# EAGLE design Quadcopter_Schematic_Final (EAGLE 7.2.0)
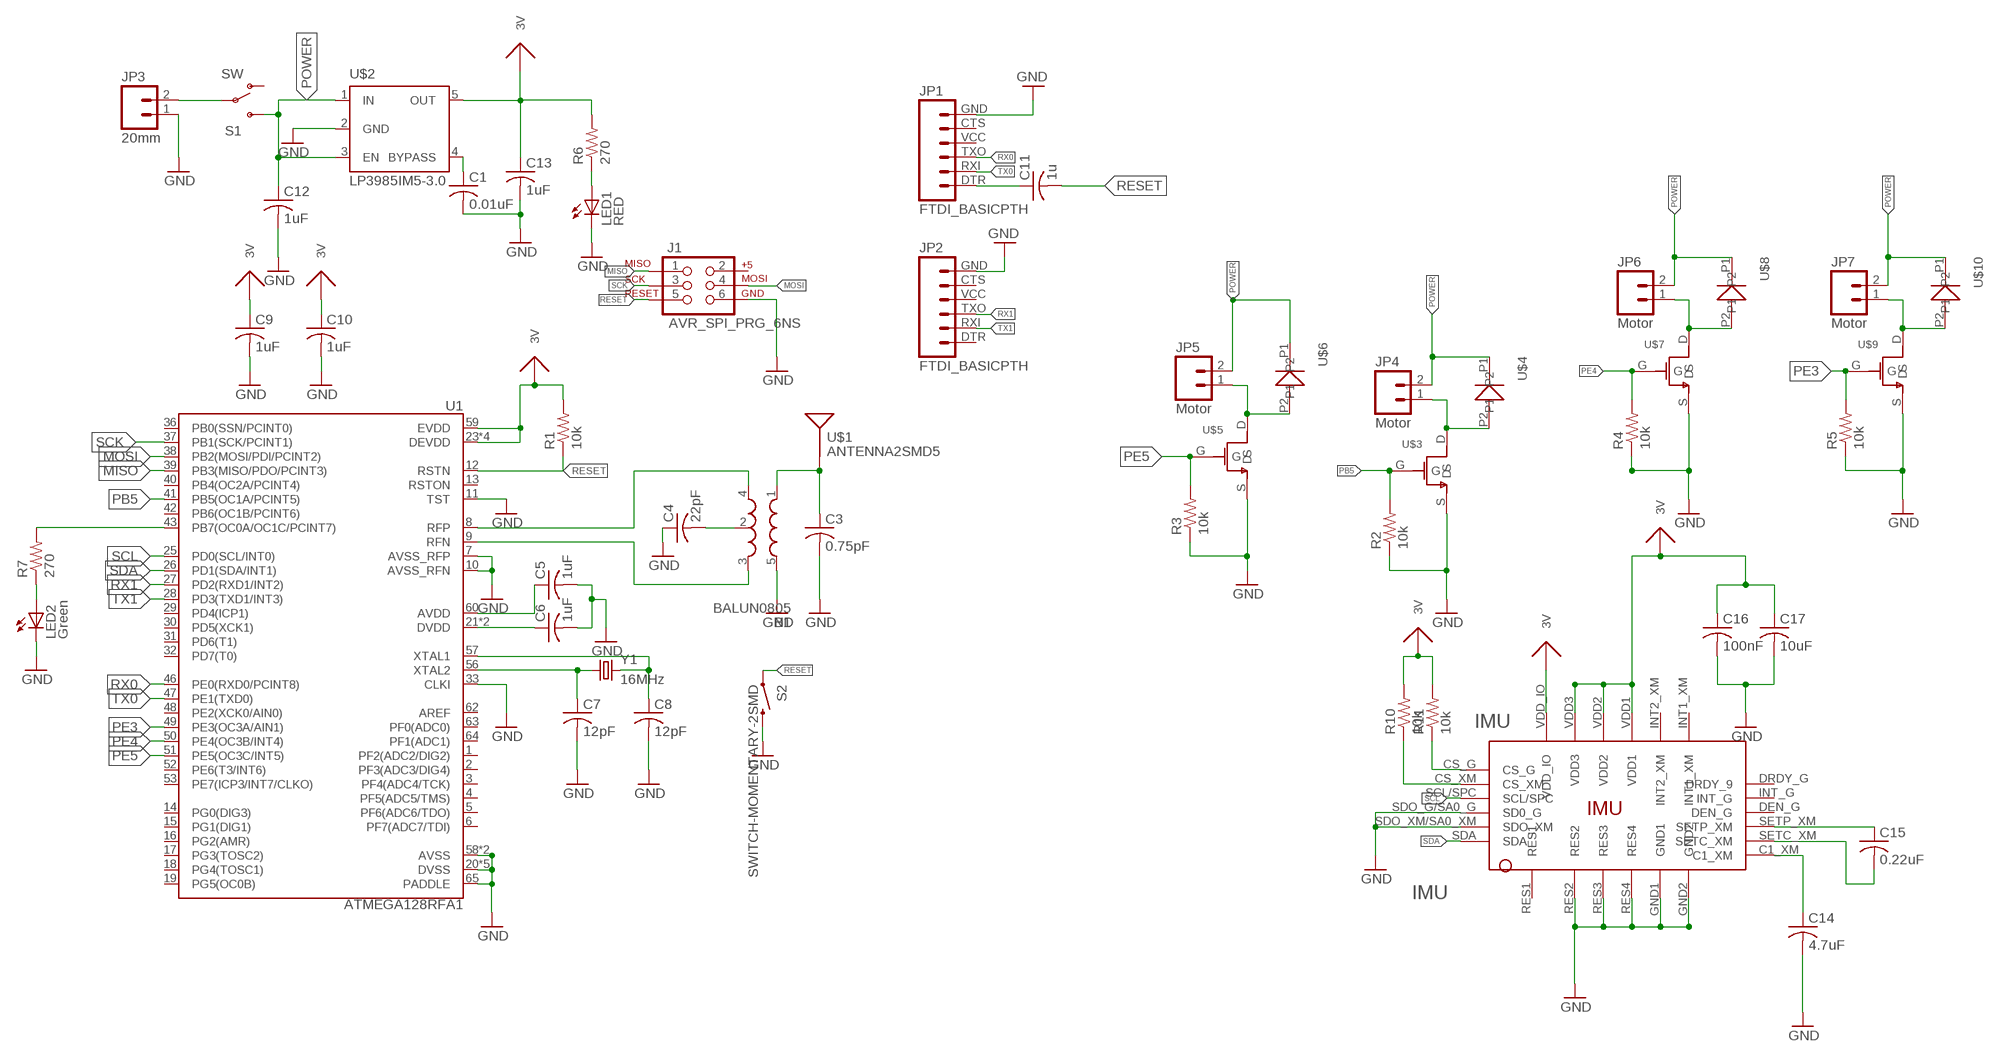
[diagram p0: schematic, sheet 1]

## Parts
B1  BALUN0805  [BALUN]
C1  0.01uF  C-USC0805  [C0805]
C3  0.75pF  C-USC0805  [C0805]
C4  22pF  C-USC0805  [C0805]
C5  1uF  C-USC0805  [C0805]
C6  1uF  C-USC0805  [C0805]
C7  12pF  C-USC0805  [C0805]
C8  12pF  C-USC0805  [C0805]
C9  1uF  C-USC0805  [C0805]
C10  1uF  C-USC0805  [C0805]
C11  1u  C-USC0805  [C0805]
C12  1uF  C-USC0805  [C0805]
C13  1uF  C-USC0805  [C0805]
C14  4.7uF  C-USC0805  [C0805]
C15  0.22uF  C-USC0805  [C0805]
C16  100nF  C-USC0805  [C0805]
C17  10uF  C-USC0805  [C0805]
IMU  IMU  LSM9DS0  [LSM9DS0]
J1  AVR_SPI_PRG_6NS  [2X3-NS]
JP1  FTDI_BASICPTH  [FTDI_BASIC]
JP2  FTDI_BASICPTH  [FTDI_BASIC]
JP3  20mm  M02PTH  [1X02]
JP4  Motor  M02PTH  [1X02]
JP5  Motor  M02PTH  [1X02]
JP6  Motor  M02PTH  [1X02]
JP7  Motor  M02PTH  [1X02]
LED1  RED  LEDCHIP-LED0805  [CHIP-LED0805]
LED2  Green  LEDCHIP-LED0805  [CHIP-LED0805]
R1  10k  R-US_R0805  [R0805]
R2  10k  R-US_R0805  [R0805]
R3  10k  R-US_R0805  [R0805]
R4  10k  R-US_R0805  [R0805]
R5  10k  R-US_R0805  [R0805]
R6  270  R-US_R0805  [R0805]
R7  270  R-US_R0805  [R0805]
R10  10k  R-US_R0805  [R0805]
R11  10k  R-US_R0805  [R0805]
S1  SW  SWITCH-SPDTPTH  [SWITCH-SPDT]
S2  SWITCH-MOMENTARY-2SMD  [TACTILE_SWITCH_SMD]
U1  ATMEGA128RFA1  [QFN-64]
U$1  ANTENNA2SMD5  [ANTENNA-CHIP5]
U$2  LP3985IM5-3.0  [SOT23-DBV]
U$3  NMOS  SI2302DS_MOSFET  [SI2302DS_MOSFET]
U$4  Diode  BAS16WS_DIODE  [BAS16WS_DIODE]
U$5  NMOS  SI2302DS_MOSFET  [SI2302DS_MOSFET]
U$6  Diode  BAS16WS_DIODE  [BAS16WS_DIODE]
U$7  NMOS  SI2302DS_MOSFET  [SI2302DS_MOSFET]
U$8  Diode  BAS16WS_DIODE  [BAS16WS_DIODE]
U$9  NMOS  SI2302DS_MOSFET  [SI2302DS_MOSFET]
U$10  Diode  BAS16WS_DIODE  [BAS16WS_DIODE]
Y1  16MHz  CRYSTAL5X3  [CRYSTAL-SMD-5X3]

## Nets
3V: C9.1 C10.1 C13.1 C16.1 C17.1 IMU.VDD1 IMU.VDD2 IMU.VDD3 IMU.VDD_IO R1.2 R6.2 R10.2 R11.2 U1.23(DEVDD) U1.34(DEVDD) U1.44(DEVDD) U1.54(DEVDD) U1.59(EVDD) U$2.5(OUT)
FTDI: C11.1 JP1.DTR
GND: B1.5(GND) C1.2 C3.2 C4.1 C5.2 C6.2 C7.2 C8.2 C9.2 C10.2 C12.2 C13.2 C14.2 C16.2 C17.2 IMU.GND1 IMU.GND2 IMU.RES2 IMU.RES3 IMU.RES4 IMU.SDO_G/SA0_G(SD0_G) IMU.SDO_XM/SA0_XM(SDO_XM) J1.6 JP1.GND JP2.GND JP3.1 LED1.C LED2.C R2.1 R3.1 R4.1 R5.1 S2.3 U1.7(AVSS_RFP) U1.10(AVSS_RFN) U1.11(TST) U1.20(DVSS) U1.24(DVSS) U1.33(CLKI) U1.35(DVSS) U1.45(DVSS) U1.55(DVSS) U1.58(AVSS) U1.61(AVSS) U1.65(PADDLE) U$2.2(GND) U$3.S U$5.S U$7.S U$9.S
MISO: J1.1 U1.39(PB3(MISO/PDO/PCINT3))
MOSI: J1.4 U1.38(PB2(MOSI/PDI/PCINT2))
N$1: B1.4(OUT1) U1.8(RFP)
N$2 [HIGHCURRENT]: JP5.1 U$5.D U$6.P2
N$3: JP3.2 S1.2(P)
N$4: C5.1 U1.60(AVDD)
N$5: C6.1 U1.21(DVDD) U1.22(DVDD)
N$6: B1.2(GND) C4.2
N$7: B1.3(OUT2) U1.9(RFN)
N$8: C8.1 U1.57(XTAL1) Y1.3
N$9 [RFSIG]: B1.1(IN) C3.1 U$1.FEED(SIGNAL)
N$10: LED1.A R6.1
N$11: LED2.A R7.1
N$12: C7.1 U1.56(XTAL2) Y1.1
N$14: C1.1 U$2.4(BYPASS)
N$15: IMU.CS_G R11.1
N$16: IMU.CS_XM R10.1
N$22 [HIGHCURRENT]: JP4.1 U$3.D U$4.P2
N$23: C14.1 IMU.C1_XM
N$24: C15.2 IMU.SETC_XM
N$25: C15.1 IMU.SETP_XM
N$33 [HIGHCURRENT]: JP6.1 U$7.D U$8.P2
N$38: JP7.1 U$9.D U$10.P2
PB5: R2.2 U1.41(PB5(OC1A/PCINT5)) U$3.G
PB7: R7.2 U1.43(PB7(OC0A/OC1C/PCINT7))
PE3: R5.2 U1.49(PE3(OC3A/AIN1)) U$9.G
PE4: R4.2 U1.50(PE4(OC3B/INT4)) U$7.G
PE5: R3.2 U1.51(PE5(OC3C/INT5)) U$5.G
POWER [HIGHCURRENT]: C12.1 JP4.2 JP5.2 JP6.2 JP7.2 S1.3(S) U$2.1(IN) U$2.3(EN) U$4.P1 U$6.P1 U$8.P1 U$10.P1
RESET: C11.2 J1.5 R1.1 S2.1 U1.12(RSTN)
RX0: JP1.TXO U1.46(PE0(RXD0/PCINT8))
RX1: JP2.TXO U1.27(PD2(RXD1/INT2))
SCK: J1.3 U1.37(PB1(SCK/PCINT1))
SCL: IMU.SCL/SPC U1.25(PD0(SCL/INT0))
SDA: IMU.SDA U1.26(PD1(SDA/INT1))
TX0: JP1.RXI U1.47(PE1(TXD0))
TX1: JP2.RXI U1.28(PD3(TXD1/INT3))
Unconnected: IMU.DEN_G IMU.DRDY_G(DRDY_9) IMU.INT1_XM IMU.INT2_XM IMU.INT_G IMU.RES1 J1.2 JP1.CTS JP1.VCC JP2.CTS JP2.DTR JP2.VCC S1.1(O) U1.1(PF2(ADC2/DIG2)) U1.2(PF3(ADC3/DIG4)) U1.3(PF4(ADC4/TCK)) U1.4(PF5(ADC5/TMS)) U1.5(PF6(ADC6/TDO)) U1.6(PF7(ADC7/TDI)) U1.13(RSTON) U1.14(PG0(DIG3)) U1.15(PG1(DIG1)) U1.16(PG2(AMR)) U1.17(PG3(TOSC2)) U1.18(PG4(TOSC1)) U1.19(PG5(OC0B)) U1.29(PD4(ICP1)) U1.30(PD5(XCK1)) U1.31(PD6(T1)) U1.32(PD7(T0)) U1.36(PB0(SSN/PCINT0)) U1.40(PB4(OC2A/PCINT4)) U1.42(PB6(OC1B/PCINT6)) U1.48(PE2(XCK0/AIN0)) U1.52(PE6(T3/INT6)) U1.53(PE7(ICP3/INT7/CLKO)) U1.62(AREF) U1.63(PF0(ADC0)) U1.64(PF1(ADC1))

## Library data of the parts
B1 = Lab5:BALUN: 0805 footprint balun- Ember 351/357
C1 C3-C17 = Lab5:C-US: CAPACITOR, American symbol
IMU = Andranik-Lab4:LSM9DS0; DIST: Digikey; DISTPN: LSM9DS0
J1 = Lab5:AVR_SPI_PRG_6: AVR ISP 6 Pin This is the reduced ISP connector for AVR programming. Common on Arduino. This footprint will take up less PCB space and can be used with a 10-pin to 6-pin adapter such as SKU: BOB-08508
JP1 JP2 = Lab5:FTDI_BASIC: FTDI Basic header with labels
JP3-JP7 = Lab5:M02: Header 2 Standard 2-pin 0.1" header. Use with straight break away headers (SKU : PRT-00116), right angle break away headers (PRT-00553), swiss pins (PRT-00743), machine pins (PRT-00117), and female headers (PRT-00115). Molex polarized connector foot print use with SKU : PRT-08233 with associated crimp pins and housings.
LED1 LED2 = Lab5:LED: LED OSRAM: - CHIPLED LG R971, LG N971, LY N971, LG Q971, LY Q971, LO R971, LY R971 LH N974, LH R974 LS Q976, LO Q976, LY Q976 LO Q996 - Hyper CHIPLED LW Q18S LB Q993, LB Q99A, LB R99A - SideLED LS A670, LO A670, LY A670, LG A670, LP A670 LB A673, LV A673, LT A673, LW A673 LH A674 LY A675 LS A676, LA A676, LO A676, LY A676, LW A676 LS A679, LY A679, LG A679 - Hyper Micro SIDELED® LS Y876, LA Y876, LO Y876, LY Y876 LT Y87S - SmartLED LW L88C, LW L88S LB L89C, LB L89S, LG L890 LS L89K, LO L89K, LY L89K LS L896, LA L896, LO L896, LY L896 - TOPLED LS T670, LO T670, LY T670, LG T670, LP T670 LSG T670, LSP T670, LSY T670, LOP T670, LYG T670 LG T671, LOG T671, LSG T671 LB T673, LV T673, LT T673, LW T673 LH T674 LS T676, LA T676, LO T676, LY T676, LB T676, LH T676, LSB T676, LW T676 LB T67C, LV T67C, LT T67C, LS T67K, LO T67K, LY T67K, LW E67C LS E67B, LA E67B, LO E67B, LY E67B, LB E67C, LV E67C, LT E67C LW T67C LS T679, LY T679, LG T679 LS T770, LO T770, LY T770, LG T770, LP T770 LB T773, LV T773, LT T773, LW T773 LH T774 LS E675, LA E675, LY E675, LS T675 LS T776, LA T776, LO T776, LY T776, LB T776 LHGB T686 LT T68C, LB T68C - Hyper Mini TOPLED® LB M676 - Mini TOPLED Santana® LG M470 LS M47K, LO M47K, LY M47K Source: http://www.osram.convergy.de LUXEON: - LUMILED® LXK2-PW12-R00, LXK2-PW12-S00, LXK2-PW14-U00, LXK2-PW14-V00 LXK2-PM12-R00, LXK2-PM12-S00, LXK2-PM14-U00 LXK2-PE12-Q00, LXK2-PE12-R00, LXK2-PE12-S00, LXK2-PE14-T00, LXK2-PE14-U00 LXK2-PB12-K00, LXK2-PB12-L00, LXK2-PB12-M00, LXK2-PB14-N00, LXK2-PB14-P00, LXK2-PB14-Q00 LXK2-PR12-L00, LXK2-PR12-M00, LXK2-PR14-Q00, LXK2-PR14-R00 LXK2-PD12-Q00, LXK2-PD12-R00, LXK2-PD12-S00 LXK2-PH12-R00, LXK2-PH12-S00 LXK2-PL12-P00, LXK2-PL12-Q00, LXK2-PL12-R00 Source: www.luxeon.com KINGBRIGHT: KA-3528ASYC Source: www.kingbright.com
R1-R7 R10 R11 = Lab5:R-US_: RESISTOR, American symbol
S1 = Lab5:SWITCH-SPDT: SPDT Switch Simple slide switch, Spark Fun Electronics SKU : COM-00102 DPDT SMT slide switch, AYZ0202, SWCH-08179; PROD_ID: SWCH-08261
S2 = Lab5:SWITCH-MOMENTARY-2: Various NO switches- pushbuttons, reed, etc
U1 = Lab5:ATMEGA128RFA1: ATmega128RFA1 8-bit AVR Microcontroller with Low Power 2.4GHz Transceiver for ZigBee and IEEE 802.15.4
U$1 = Lab5:ANTENNA2: Chip antenna Single endded antenna. Common with smaller chip antennas. CHIP4 package is the GPS Chip Antenna SKU: GPS-08418. CHIP5 package is 2.4GHz chip antenna SKU: WRL-00144.
U$2 = Lab5:LP3985IM5-3.0
U$3 U$5 U$7 U$9 = Andranik-Lab4:SI2302DS_MOSFET; DIST: Digikey; DISTPN: Si2302CDS
U$4 U$6 U$8 U$10 = Andranik-Lab4:BAS16WS_DIODE; DIST: VISHAY; DISTPT: BAS16WS
Y1 = Lab5:CRYSTAL: Various standard crystals. Proven footprints. Spark Fun Electronics SKU : COM-00534

## Net classes
0 default: clearance 0.205 mm
1 RFSIG: width 0.457 mm
2 HIGHCURRENT: width 0.457 mm

## Board
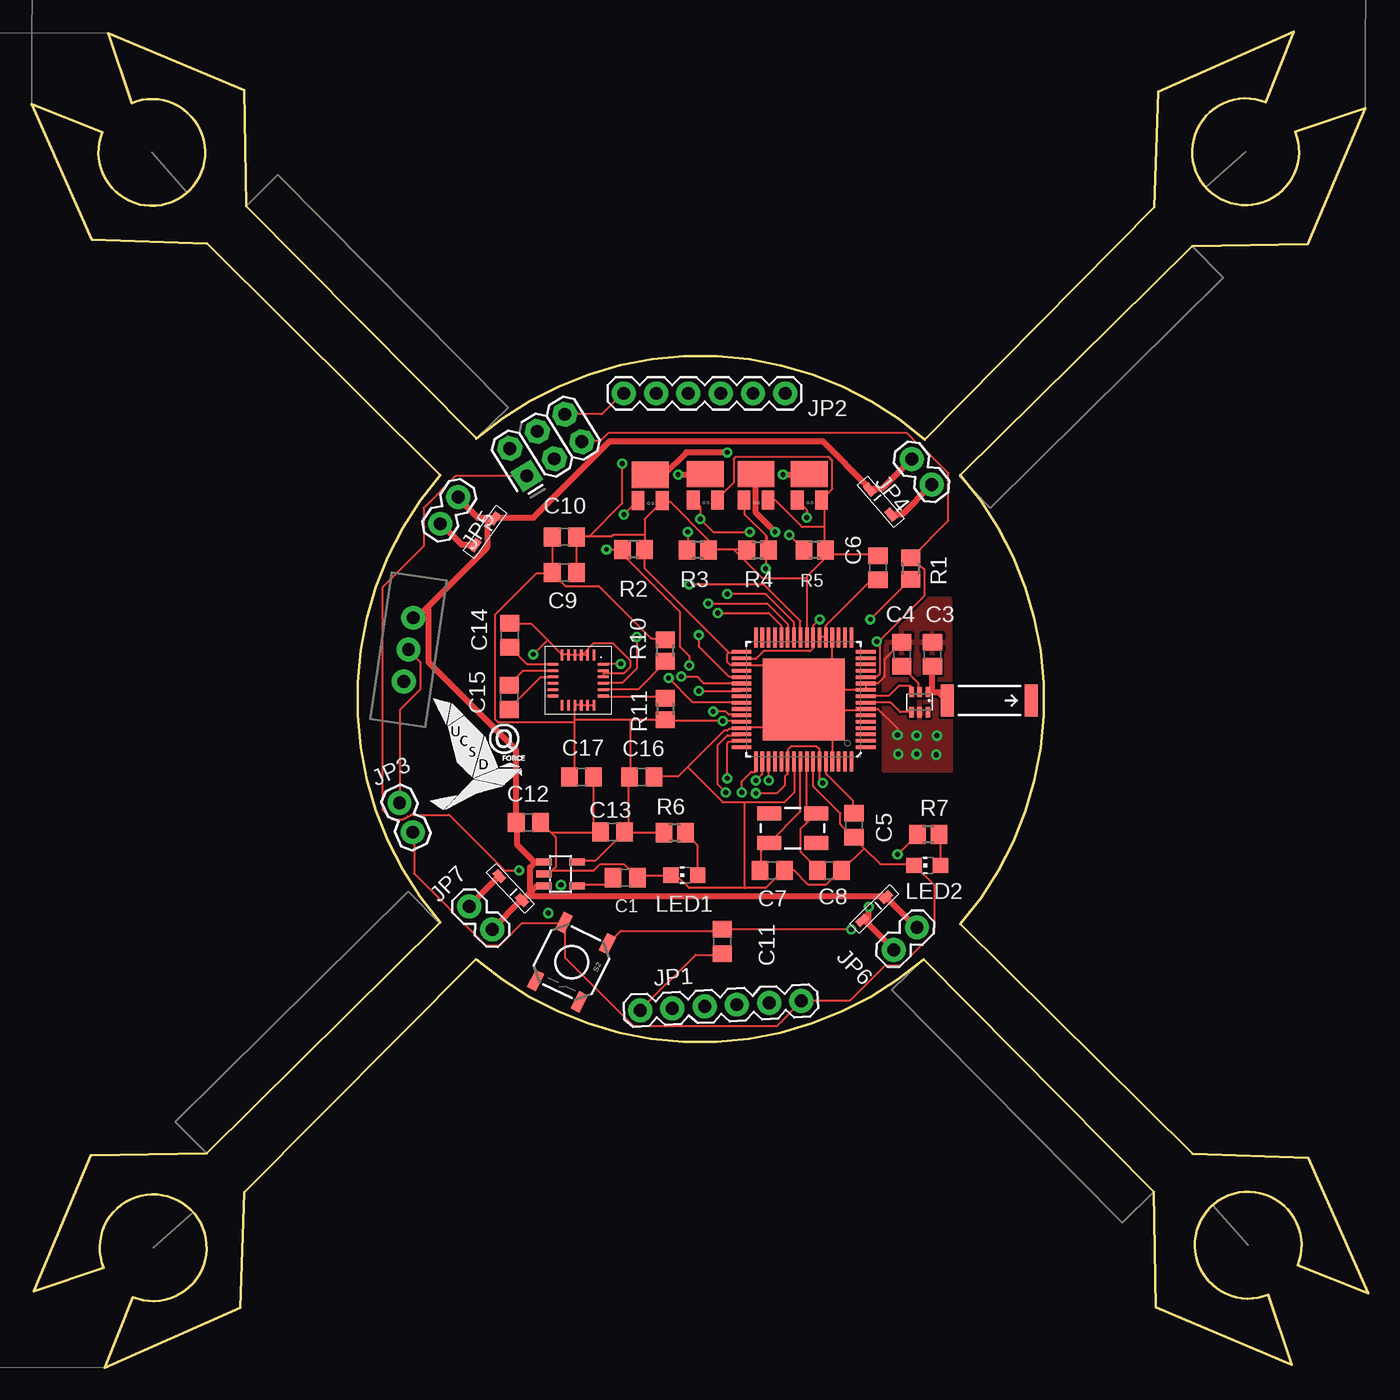
[diagram p1: board, top side]
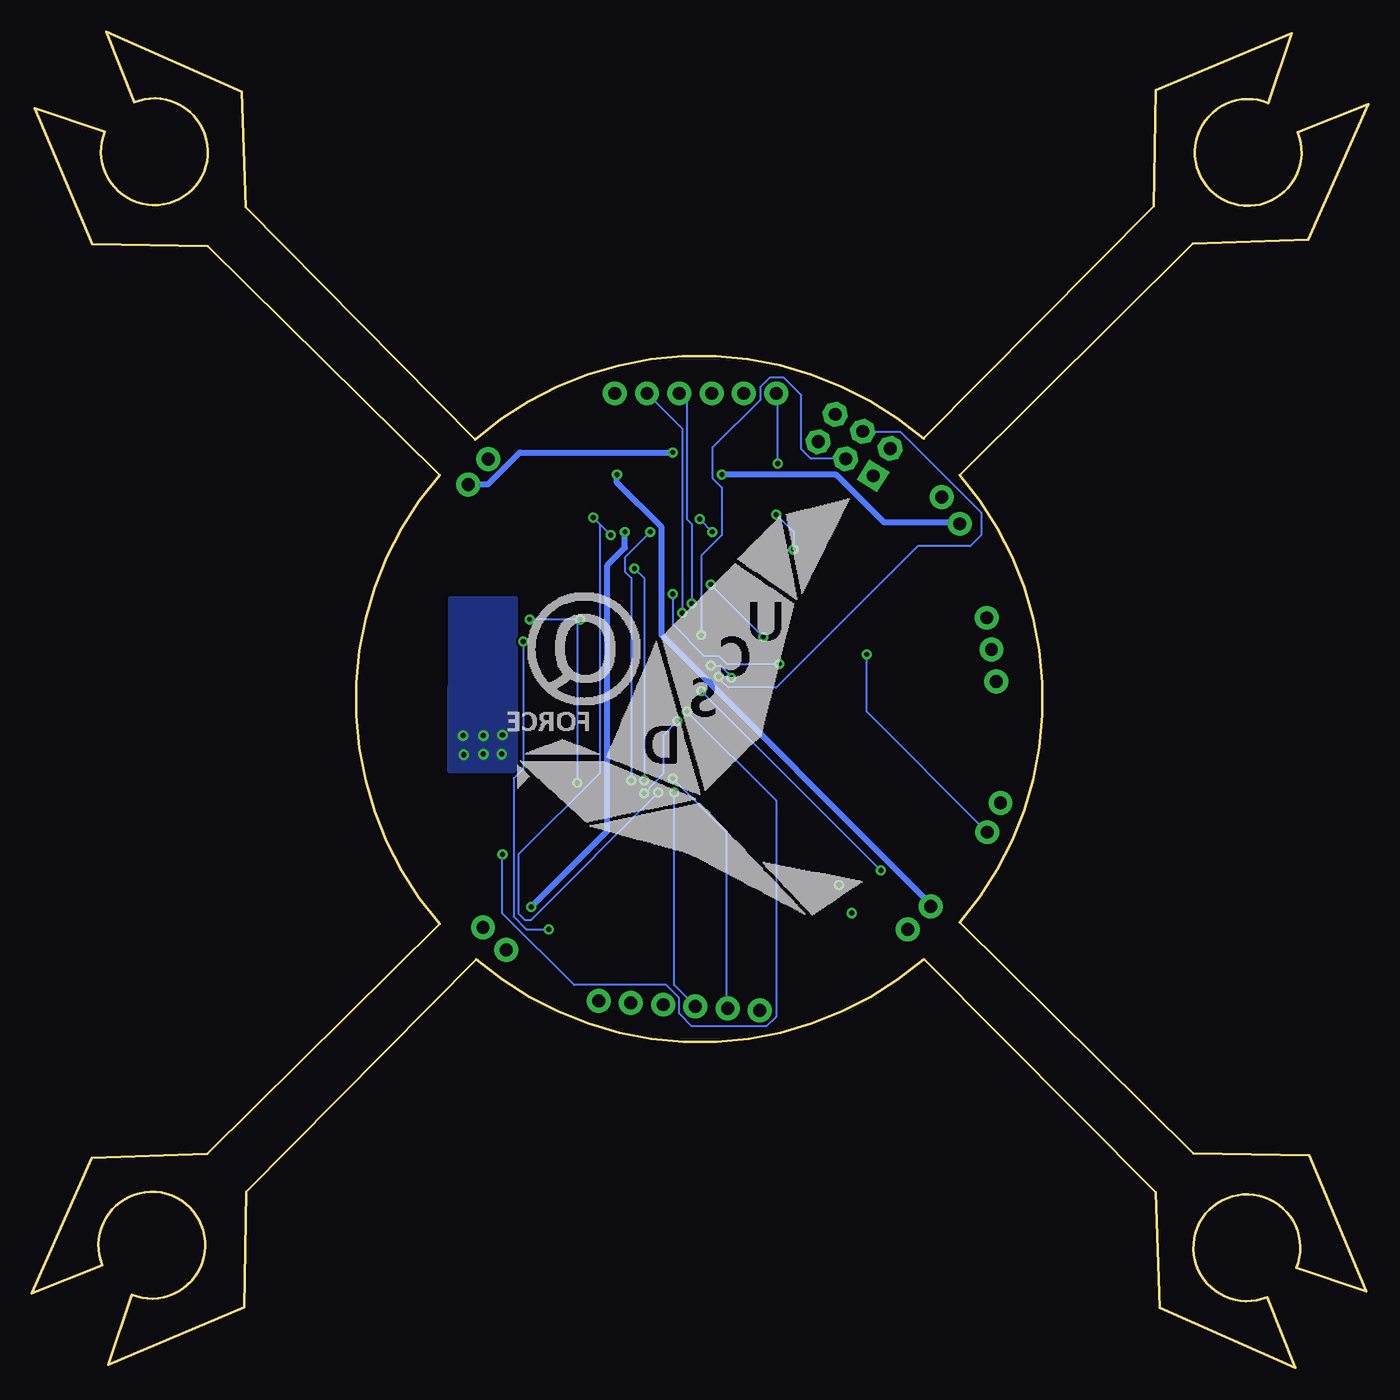
[diagram p2: board, bottom side, seen from below]

Size 105.05 x 105.05 mm. Coordinates in mm from the lower left corner, seen from the top.
Outline: 34.9,73.15 16.85,91.35 16.7,100.45 6,104.95 7.85,99.45 arc-314 5.55,97.15 0,99.35 4.7,88.7 13.8,88.4 32.1,70.2 arc81 32.1,35 13.75,16.85 4.65,16.7 0.15,6 5.65,7.85 arc-314 7.95,5.55 5.75,0 16.4,4.7 16.7,13.8 34.9,32.1
Outline: 34.95,73.05 arc-82 70.2,73 88.25,91.25 88.55,100.35 99.2,105.05 97,99.5 arc314 99.3,97.2 104.8,99.05 100.3,88.35 91.2,88.2 73,70.2 arc-82 73,34.9 91.25,16.8 100.35,16.5 105.05,5.85 99.5,8.05 arc314 97.2,5.75 99.05,0.25 88.35,4.75 88.2,13.85 70.1,32.1 arc-81 34.95,32.1
Copper layers (1*16): Top 0.035559375mm / dielectric 1.501140625mm / Bottom 0.035559375mm
Design rules "4pcb-33board": minimum track width 6mil, minimum drill 15mil, track to track 6mil, track to pad 6mil, pad to pad 6mil, via to via 6mil, smd to smd 6mil, copper to edge 10mil, drill to drill 10mil, minimum pad ring 10mil, minimum via ring 8mil, stop-mask expansion 4mil, vias tented up to drill 0mil, thermal gap 10mil
tRestrict: area 72.7,44.5 to 77.8,64.9; area 40.4,55.6 to 41.3,56.6; area 44.4,55.6 to 45.5,56.6; area 44.5,51.6 to 45.4,52.4; area 40.4,51.7 to 41.3,52.5; area 41.6,52.9 to 44.2,55.2
bRestrict: area 72.6,44.4 to 77.8,65; area 41.6,52.8 to 44.2,55.3; area 40.4,51.6 to 41.3,52.5; area 44.5,51.6 to 45.4,52.5; area 40.4,55.6 to 41.3,56.6; area 44.5,55.6 to 45.5,56.7

### Footprints (pad centres in the part's own frame; a part is rotated, then mirrored left to right if it is on the bottom)
BALUN = smd 0.35 x 0.8: 1 -0.65,-0.8; 2 0,-0.8; 3 0.65,-0.8; 4 0.65,0.8; 5 0,0.8; 6 -0.65,0.8
C0805 = smd 1.3 x 1.5: 1 -0.95,0; 2 0.95,0
LSM9DS0 = smd 0.85 x 0.2: C1_XM 1.975,-1.25; CS_G -1.975,1.25; CS_XM -1.975,0.75; DEN_G 1.975,0.25; DRDY_G 1.975,1.25; INT_G 1.975,0.75; SCL/SPC -1.975,0.25; SDA -1.975,-1.25; SDO_G/SA0_G -1.975,-0.25; SDO_XM/SA0_XM -1.975,-0.75; SETC_XM 1.975,-0.75; SETP_XM 1.975,-0.25 | smd 0.2 x 0.85: GND1 0.75,-1.975; GND2 1.25,-1.975; INT1_XM 1.25,1.975; INT2_XM 0.75,1.975; RES1 -1.25,-1.975; RES2 -0.75,-1.975; RES3 -0.25,-1.975; RES4 0.25,-1.975; VDD1 0.25,1.975; VDD2 -0.25,1.975; VDD3 -0.75,1.975; VDD_IO -1.25,1.975
2X3-NS = drill 1.016 pad 1.88 square: 1 -2.54,-1.27 | drill 1.016 pad 1.88 octagon: 2 -2.54,1.27; 3 0,-1.27; 4 0,1.27; 5 2.54,-1.27; 6 2.54,1.27
FTDI_BASIC = drill 1.016 pad 1.88: CTS 10.16,0; DTR 0,0; GND 12.7,0; RXI 2.54,0; TXO 5.08,0; VCC 7.62,0
1X02 = drill 1.016 pad 1.88: 1 0,0; 2 2.54,0
CHIP-LED0805 = smd 1.2 x 1.2: A 0,-1.05; C 0,1.05
R0805 = smd 1.3 x 1.5: 1 -0.85,0; 2 0.85,0
SWITCH-SPDT = drill 1.016 pad 1.88: 1 0,2.54; 2 0,0; 3 0,-2.54
TACTILE_SWITCH_SMD = smd 1.524 x 0.762: 1 -2.54,1.905; 2 2.54,1.905; 3 -2.54,-1.905; 4 2.54,-1.905
QFN-64 = smd 1.562 x 0.28: 1 -4.881,3.75; 2 -4.881,3.25; 3 -4.881,2.75; 4 -4.881,2.25; 5 -4.881,1.75; 6 -4.881,1.25; 7 -4.881,0.75; 8 -4.881,0.25; 9 -4.881,-0.25; 10 -4.881,-0.75; 11 -4.881,-1.25; 12 -4.881,-1.75; 13 -4.881,-2.25; 14 -4.881,-2.75; 15 -4.881,-3.25; 16 -4.881,-3.75; 33 4.881,-3.75; 34 4.881,-3.25; 35 4.881,-2.75; 36 4.881,-2.25; 37 4.881,-1.75; 38 4.881,-1.25; 39 4.881,-0.75; 40 4.881,-0.25; 41 4.881,0.25; 42 4.881,0.75; 43 4.881,1.25; 44 4.881,1.75; 45 4.881,2.25; 46 4.881,2.75; 47 4.881,3.25; 48 4.881,3.75 | smd 0.28 x 1.562: 17 -3.75,-4.881; 18 -3.25,-4.881; 19 -2.75,-4.881; 20 -2.25,-4.881; 21 -1.75,-4.881; 22 -1.25,-4.881; 23 -0.75,-4.881; 24 -0.25,-4.881; 25 0.25,-4.881; 26 0.75,-4.881; 27 1.25,-4.881; 28 1.75,-4.881; 29 2.25,-4.881; 30 2.75,-4.881; 31 3.25,-4.881; 32 3.75,-4.881; 49 3.75,4.881; 50 3.25,4.881; 51 2.75,4.881; 52 2.25,4.881; 53 1.75,4.881; 54 1.25,4.881; 55 0.75,4.881; 56 0.25,4.881; 57 -0.25,4.881; 58 -0.75,4.881; 59 -1.25,4.881; 60 -1.75,4.881; 61 -2.25,4.881; 62 -2.75,4.881; 63 -3.25,4.881; 64 -3.75,4.881 | smd 6.452 x 6.452: 65 0,0
ANTENNA-CHIP5 = smd 1.016 x 2.54: FEED -3.302,0; NC 3.302,0
SOT23-DBV = smd 0.55 x 1.2: 1 -0.95,-1.3; 2 0,-1.3; 3 0.95,-1.3; 4 0.95,1.3; 5 -0.95,1.3
SI2302DS_MOSFET = smd 2.9 x 2.05: D 0,1.85 | smd 1 x 1.5: G -0.95,-0.175; S 0.95,-0.175
BAS16WS_DIODE = smd 1 x 0.6: P1 -1.3,0; P2 1.3,0
CRYSTAL-SMD-5X3 = smd 1.9 x 1.1: 1 -1.85,-1.15; 2 1.85,-1.15; 3 1.85,1.15; 4 -1.85,1.15

### Placement (x,y rotation side)
B1  69.79,52.34 180 top
C1  46.65,38.53 0 top
C3  70.8,56.1 90 top
C4  68.4,56.1 270 top
C5  64.63,42.66 270 top
C6  66.52,62.91 90 top
C7  58.2,39.1 0 top
C8  62.7,39.1 0 top
C9  41.86,62.53 0 top
C10  41.86,65.33 0 top
C11  54.27,33.52 90 top
C12  39.03,42.88 0 top
C13  45.65,42.12 180 top
C14  37.57,57.59 90 top
C15  37.52,52.71 90 top
C16  47.95,46.45 0 top
C17  43.2,46.45 0 top
IMU  42.94,54.07 180 top
J1  40.41,72.55 31.8 top
JP1  47.82,28.11 3.3 top
JP2  59.23,76.62 180 top
JP3  29.95,42.11 114.3 top
JP4  70.74,69.45 128.5 top
JP5  32.1,66.36 56.2 top
JP6  67.75,32.86 43.9 top
JP7  34.4,36.26 314.7 top
LED1  51.29,38.73 90 top
LED2  70.39,39.49 90 top
R1  69.08,62.84 270 top
R2  47.3,64.35 180 top
R3  52.35,64.3 180 top
R4  57.05,64.3 0 top
R5  61.55,64.3 180 top
R6  50.53,42.07 180 top
R7  70.46,41.92 180 top
R10  49.8,56.4 90 top
R11  49.78,51.8 270 top
S1  29.61,56.46 171.7 top
S2  42.43,31.89 243.9 top
U1  60.67,52.55 180 top
U$1  75.27,52.46 0 top
U$2  41.56,38.83 270 top
U$3  48.6,68.36 0 top
U$4  66.71,68.07 310.7 top
U$5  52.94,68.41 0 top
U$6  35.61,65.74 234.1 top
U$7  56.93,68.41 0 top
U$8  66.21,36.09 224.6 top
U$9  61.12,68.41 0 top
U$10  37.64,37.72 133.2 top
U$11  [LOGOSBOTTOM]  33.4,33.25 0 top
U$12  [LOGOS]  29.6,43.25 0 top
Y1  59.81,42.43 0 top

### Tracks (layer width: path | path; a pad name or v marks a point on that pad's centre or on a via)
3V  (via drill 0.38)
  Top 0.152: v65.92,58.85 69.05,61.98 R1.2 | v61.92,58.85 61.42,58.35 61.42,57.48 U1.23 61.42,57.35 61.42,56.6 61.17,56.35 57.55,56.35 56.92,55.73 55.8,55.73 U1.34 | v62.17,45.98 61.92,46.23 61.92,47.6 U1.59 61.92,47.73 61.92,48.6 61.67,48.85 59.67,48.85 59.42,48.6 59.42,47.73 U1.54 59.42,47.6 59.42,46.73 59.2,46.5 59.2,45.8 58.57,45.18 v56.92,45.18 | C9.1 40.92,62.6 40.92,65.22 C10.1 | R10.2 49.8,57.35 48.67,57.35 44.55,61.48 41.92,61.48 40.92,62.48 C9.1 | U$2.5 42.92,39.85 44.3,39.85 46.55,42.1 C13.1 | C13.1 46.67,42.23 46.92,42.48 46.92,46.35 C16.1 47.05,46.48 47.05,50.98 | R6.2 49.67,42.1 46.67,42.1 C13.1 | U1.44 55.67,50.85 v54.3,50.85 49.8,50.85 R11.2 49.67,50.98 47.05,50.98 | 43.17,52.1 42.67,52.1 IMU.VDD1 42.67,51.98 42.67,50.98 | 43.17,52.1 43.67,52.1 | 43.17,52.1 IMU.VDD2 | 43.67,52.1 44.17,52.1 IMU.VDD_IO | 43.67,52.1 IMU.VDD3 | 42.67,50.73 42.67,46.85 42.3,46.48 C17.1 | 42.67,50.73 42.67,50.98 | 42.67,50.98 47.05,50.98 | 42.67,50.73 36.67,50.73 36.42,50.98 36.42,59.23 39.67,62.48 40.8,62.48 C9.1
  Bottom 0.152: 62.17,58.85 v65.92,58.85 | 62.17,58.85 v62.17,45.98 | 62.17,58.85 v61.92,58.85 | v56.92,45.18 55.42,46.73 55.42,49.73 v54.3,50.85
FTDI
  Top 0.152: C11.1 54.17,32.48 52.17,32.48 47.92,28.23 JP1.DTR
GND  (via drill 0.38, 0.4)
  Top 0.152: 62.3,68.47 62.17,68.35 U$9.S 62.3,68.47 | 62.3,68.47 62.92,69.1 62.92,71.35 62.67,71.6 55.3,71.6 55.17,71.47 55.17,69.6 53.92,68.35 U$5.S | 62.3,68.47 62.3,66.1 | 62.3,66.1 62.3,64.35 R5.1 | 62.67,63.98 66.42,63.98 C6.2 | 62.67,63.98 62.42,64.22 R5.1 | 62.3,66.1 60.55,66.1 58.42,68.22 57.92,68.22 U$7.S | 60.92,62.1 60.92,62.23 62.67,63.98 | 60.92,62.1 60.92,57.48 U1.24 | 62.67,63.98 R5.1 | J1.6 41.92,74.97 44.8,74.97 46.42,76.6 JP2.GND | 55.17,64.35 56.17,64.35 R4.1 | 55.17,64.35 53.3,64.35 R3.1 53.17,64.35 53.17,65.1 50.17,68.1 49.55,68.1 | C9.2 42.8,62.6 42.8,65.22 C10.2 42.92,65.35 43.8,65.35 | 48.17,65.47 48.17,66.72 49.55,68.1 | 48.17,65.47 48.17,64.35 | 43.8,65.35 45.55,65.35 45.67,65.47 48.17,65.47 | 49.55,68.1 U$3.S | v46.42,71.1 46.42,67.97 43.8,65.35 | 60.92,62.1 57.42,62.1 55.17,64.35 | 44.92,54.6 44.92,54.73 IMU.SDO_XM/SA0_XM | 44.92,54.6 44.92,54.35 IMU.SDO_G/SA0_G | 42.17,56.1 41.67,56.1 | 42.17,56.1 42.67,56.1 | 42.17,56.1 IMU.GND1 | 42.67,56.1 43.17,56.1 | 42.67,56.1 IMU.RES4 | 43.17,56.1 43.3,56.1 | 43.3,56.1 43.67,56.1 IMU.RES2 | 43.17,56.1 IMU.RES3 | 44.92,54.6 46.55,54.6 47.05,55.1 47.05,55.6 45.67,56.98 44.17,56.98 43.3,56.1 | 41.67,56.1 40.55,57.23 | 40.55,57.23 39.3,58.48 37.67,58.48 C14.2 | 41.67,56.1 IMU.GND2 | JP3.1 30.05,42.1 30.05,38.85 35.67,33.23 36.8,33.23 38.55,34.98 41.8,34.98 S2.3 41.92,34.98 41.92,32.23 47.3,26.85 58.55,26.85 60.42,28.73 JP1.GND 60.55,28.85 64.3,28.85 67.05,31.6 68.3,31.6 70.92,34.23 70.92,37.98 69.42,39.48 LED2.C 69.3,39.6 66.67,39.6 65.42,40.85 | v39.42,56.1 40.55,57.23 | 51.55,47.23 54.42,50.1 54.67,50.1 54.8,50.23 55.67,50.23 U1.45 55.8,50.35 62.8,50.35
  Top 0.152: 51.55,47.23 50.8,46.48 48.92,46.48 C16.2 | 56.05,44.48 54.3,44.48 51.55,47.23 | 56.05,44.48 59.17,44.48 59.95,45.25 59.95,47.58 59.92,47.6 U1.55 | 65.55,53.35 65.55,53.73 U1.11 65.67,53.85 66.55,53.85 67.05,54.35 67.05,55.73 68.3,56.98 C4.1 | 61.42,51.73 60.67,52.48 U1.65 | 61.42,51.73 62.8,50.35 | 62.8,50.35 62.92,50.23 62.92,47.73 U1.61 | 61.42,51.73 62.92,51.73 | 62.92,51.73 65.55,51.73 | 65.55,51.73 U1.7 | 61.42,51.73 U1.65 | U1.65 60.55,52.6 57.92,55.23 55.8,55.23 U1.35 55.67,55.23 54.92,55.23 54.67,55.48 54.67,56.1 54.8,56.23 | 54.8,56.23 55.67,56.23 U1.33 | 62.92,51.73 62.92,53.35 | 62.92,53.35 62.92,57.35 U1.20 | 62.92,51.73 U1.65 | 62.92,53.35 65.55,53.35 | 65.55,53.35 U1.10 | 62.92,53.35 U1.65 | 62.8,50.35 U1.65 | 40.92,39.1 41.17,39.35 41.17,41.73 40.8,42.1 | 40.92,39.1 40.67,38.85 40.3,38.85 U$2.2 | 40.8,42.1 40.05,42.85 C12.2 | 40.8,42.1 44.17,42.1 | 44.17,42.1 44.67,42.1 C13.2 44.17,42.1 | 44.17,42.1 44.17,46.35 C17.2 | 40.92,39.1 44.17,39.1 44.67,39.6 46.55,39.6 47.55,38.6 C1.2 47.67,38.6 47.8,38.73 50.17,38.73 LED1.C 50.3,38.73 50.67,38.73 51.67,37.73 56.05,37.73 | 65.42,40.85 64.67,41.6 C5.2 64.55,41.73 63.55,42.73 63.55,43.6 61.42,45.73 61.42,47.6 U1.58 | 65.42,40.85 63.67,39.1 C8.2 63.55,39.1 62.42,37.98 61.05,37.98 59.92,39.1 C7.2 59.05,39.1 57.67,37.73 56.05,37.73 | 56.05,37.73 56.05,44.48 | 48.17,64.35 48.17,62.85 54.8,56.23 | 48.17,64.35 R2.1 | 65.55,51.73 65.62,51.8 66.5,51.8 68.05,50.25 v68.05,49.75
  Bottom 0.152: v46.42,71.1 46.42,76.6 JP2.GND | v39.42,56.1 39.42,51.6 30.05,42.23 JP3.1
  other vias: 69.55,49.7 71.15,49.7 68.1,48.25 69.55,48.25 71.1,48.2
  pour Bottom: 72.15,46.95 67,46.95 67,60.45 72.15,60.45 72.2,46.9
  pour Top: 72.15,46.95 67,46.95 67,60.45 72.15,60.45 72.2,46.9
MISO  (via drill 0.38)
  Top 0.152: v52.42,53.23 55.67,53.23 U1.39 | v38.3,39.1 37.17,39.1 32.8,43.48 29.8,43.48 29.67,43.35 29.55,43.35 29.42,43.23 29.3,43.23 29.17,43.1 28.3,43.1 27.55,43.85 27.55,61.35 30.8,64.6 30.8,67.6 33.3,70.1 38.8,70.1 J1.1
  Bottom 0.152: v38.3,39.1 v52.42,53.23
MOSI  (via drill 0.38)
  Top 0.152: v51.05,54.35 52.3,54.35 52.8,53.85 55.67,53.85 U1.38
  Bottom 0.152: v51.05,54.35 50.8,54.1 50.8,53.98 50.3,53.48 46.55,53.48 35.42,64.6 31.3,64.6 30.42,65.47 30.42,67.22 36.8,73.6 39.67,73.6 J1.4
N$1
  Top 0.152: B1.4 69.05,51.6 69,51.55 68.25,51.55 67.5,52.3 U1.8 65.67,52.23
N$2  (via drill 0.38)
  Top 0.457: U$6.P2 34.8,64.72 33.8,64.72 32.17,66.35 JP5.1 | v50.8,70.22 52.92,70.22 U$5.D
  Bottom 0.457: v50.8,70.22 41.8,70.22 38.05,66.47 32.17,66.47 JP5.1
N$3
  Top 0.152: JP3.2 28.92,44.48 28.92,51.73 30.55,53.35 30.55,55.48 29.67,56.35 S1.2
N$4
  Top 0.152: C5.1 64.55,43.73 64.55,44.6 62.42,46.73 62.42,47.6 U1.60
N$5
  Top 0.152: C6.1 66.42,61.85 65.92,61.85 62.42,58.35 62.42,57.48 U1.21 62.3,57.48 61.92,57.48 U1.22
N$6
  Top 0.152: B1.2 69.67,53.23 69.67,53.85 68.42,55.1 C4.2
N$7
  Top 0.152: 69.05,53.1 B1.3 69.14,53.56 69.05,53.65 68.2,53.65 67.4,52.85 65.67,52.85 U1.9
N$8
  Top 0.152: 60.92,42.85 61.55,43.48 Y1.3 | 60.92,42.85 60.42,42.35 60.42,40.6 61.67,39.35 61.67,39.1 C8.1 | 60.92,42.85 60.92,47.6 U1.57
N$9
  Top 0.457: 70.8,53.1 71.3,53.1 71.92,52.48 U$1.FEED | 70.8,53.1 70.55,53.1 B1.1 | 70.8,53.1 C3.1
N$10
  Top 0.152: LED1.A 52.3,38.85 52.3,41.1 51.42,41.98 R6.1
N$11
  Top 0.152: LED2.A 71.42,39.6 71.42,41.85 R7.1
N$12
  Top 0.152: C7.1 57.3,39.1 57.3,40.6 57.92,41.23 Y1.1 58.05,41.35 60.42,43.73 60.42,47.6 U1.56
N$13  (via drill 0.4)
  other vias: 41.6,37.95
N$14
  Top 0.152: U$2.4 42.92,37.98 45.17,37.98 45.67,38.48 C1.1
N$15
  Top 0.152: IMU.CS_G 44.92,52.73 49.67,52.73 R11.1
N$16
  Top 0.152: IMU.CS_XM 44.92,53.35 47.67,53.35 49.8,55.48 R10.1
N$17  (via drill 0.4)
  other vias: 40.6,35.75
N$22  (via drill 0.38)
  Top 0.457: U$4.P2 67.67,67.1 68.42,67.1 70.67,69.35 JP4.1 | v54.67,71.97 51.42,71.97 49.67,70.22 48.67,70.22 U$3.D
  Bottom 0.457: v54.67,71.97 66.67,71.97 69.17,69.47 70.67,69.47 JP4.1
N$23
  Top 0.152: IMU.C1_XM 40.92,55.35 38.92,55.35 37.67,56.6 C14.1
N$24
  Top 0.152: C15.2 37.55,53.73 38.64,54.82 IMU.SETC_XM
N$25
  Top 0.152: C15.1 37.55,51.85 40.02,54.32 IMU.SETP_XM
N$33  (via drill 0.38)
  Top 0.457: 65.67,34.98 67.67,32.98 JP6.1 | 65.67,34.98 65.55,35.1 65.3,35.1 U$8.P2 | v58.42,65.72 56.92,67.22 56.92,70.22 U$7.D | v65.8,36.23 65.8,35.1 65.67,34.98
  Bottom 0.457: v58.42,65.72 58.42,64.47 59.8,63.1 59.8,42.23 v65.8,36.23
N$38  (via drill 0.38)
  Top 0.457: U$10.P2 36.67,38.6 34.42,36.35 JP7.1 | v59.05,70.22 61.05,70.22 U$9.D
  Bottom 0.457: v59.05,70.22 59.05,69.6 55.55,66.1 55.55,57.6 34.3,36.35 JP7.1
PB5  (via drill 0.38)
  Top 0.152: v45.17,64.35 46.05,64.35 | 46.05,64.35 R2.2 46.42,64.35 | v46.55,67.1 47.55,68.1 U$3.G | v50.05,54.23 51.92,52.35 55.67,52.35 U1.41 | v51.67,55.23 51.67,55.98 50.92,56.73 50.92,59.48 46.05,64.35
  Bottom 0.152: v45.17,64.35 45.17,65.72 v46.55,67.1 | v50.05,54.23 50.3,54.48 50.3,54.6 50.92,55.23 v51.67,55.23
PB7  (via drill 0.38)
  Top 0.152: v68.05,40.35 69.55,41.85 R7.2 | v53.55,51.6 54.55,51.6 54.8,51.35 55.67,51.35 U1.43
  Bottom 0.152: v68.05,40.35 68.05,35.73 62.42,30.1 55.17,30.1 54.17,29.1 54.17,27.85 53.17,26.85 47.3,26.85 46.55,27.6 46.55,44.6 v53.55,51.6
PE3  (via drill 0.38)
  Top 0.152: v59.55,65.47 60.67,64.35 R5.2 | v60.92,66.85 60.92,67.47 U$9.G | v55.8,45.23 55.8,46.1 56.55,46.85 56.9,46.85 56.92,46.87 U1.49
  Bottom 0.152: v60.92,66.85 60.42,66.35 | 60.42,66.35 v59.55,65.47 | v55.8,45.23 65.8,35.23 66.3,35.23 66.8,35.73 66.8,40.35 60.42,46.73 60.42,66.35
PE4  (via drill 0.38)
  Top 0.152: 57.67,65.47 57.8,65.35 57.8,64.35 R4.2 | 57.67,65.47 56.05,67.1 56.05,68.22 U$7.G | v56.92,46.18 57.42,46.68 57.42,47.6 U1.50 | 57.67,65.47 v57.67,62.85
  Bottom 0.152: v56.92,46.18 56.92,62.1 v57.67,62.85
PE5  (via drill 0.38)
  Top 0.152: v51.55,65.72 51.55,64.35 R3.2 | U$5.G 52.05,68.22 52.55,67.72 v52.55,66.72 53.55,65.72 v56.42,65.72 | v57.92,46.18 57.92,47.6 U1.51
  Bottom 0.152: v52.55,66.72 v51.55,65.72 | v57.92,46.18 57.92,62.1 58.42,62.6 58.42,63.73 v56.42,65.72
POWER
  Top 0.457: JP6.2 69.55,34.6 67.17,36.98 U$8.P1 66.92,37.1 39.17,37.1 39.05,37.23 | JP7.2 36.17,34.48 38.42,36.73 U$10.P1 38.67,36.85 39.05,37.23 | 39.05,37.23 39.3,37.48 | 39.3,37.48 39.67,37.85 40.17,37.85 U$2.3 | 39.55,39.73 40.17,39.73 U$2.1 | 39.55,39.73 39.17,39.35 39.17,37.6 39.3,37.48 | 39.55,39.73 38.17,41.1 38.17,42.85 C12.1 38.05,43.1 38.05,48.6 31.17,55.48 31.17,59.6 31.05,59.73 | JP4.2 69.05,71.35 66.8,69.1 65.92,69.1 U$4.P1 65.8,69.22 62.17,72.85 45.42,72.85 39.42,66.85 36.55,66.85 U$6.P1 36.3,66.85 35.8,66.85 | 35.8,66.85 35.05,66.85 33.55,68.35 JP5.2 | 31.05,59.73 35.8,64.47 35.8,66.85 | 31.05,59.73 30.3,58.98 30.05,58.98 S1.3
RESET  (via drill 0.38)
  Top 0.152: S2.1 45.3,33.35 46.3,34.35 54.17,34.35 C11.2 54.3,34.48 v64.42,34.48 | 66.67,57.1 66.67,54.6 66.42,54.35 65.67,54.35 U1.12 | 66.67,57.1 66.67,57.23 70.17,60.73 70.17,62.73 69.92,62.98 69.8,62.98 69.17,63.6 R1.1 69.17,63.73 72.05,66.6 72.05,70.35 69.67,72.72 69.55,72.72 68.8,73.47 45.3,73.47 44.67,72.85 43.3,72.85 J1.5 | 66.67,57.1 v66.42,57.1
  Bottom 0.152: v64.42,34.48 66.17,34.48 67.17,35.48 67.17,46.35 66.42,47.1 v66.42,57.1
RX0  (via drill 0.38)
  Top 0.152: v54.55,45.23 53.92,45.85 53.92,48.98 54.67,49.73 55.67,49.73 U1.46
  Bottom 0.152: v54.55,45.23 54.55,30.1 52.92,28.48 JP1.TXO
RX1  (via drill 0.38)
  Top 0.152: v53.17,60.1 57.8,60.1 59.42,58.48 59.42,57.48 U1.27
  Bottom 0.152: v53.17,60.1 53.17,66.35 53.55,66.72 53.55,76.1 54.05,76.6 JP2.TXO
SCK  (via drill 0.38)
  Top 0.152: v52.42,57.6 52.42,56.73 54.8,54.35 55.67,54.35 U1.37
  Bottom 0.152: v52.42,57.6 52.42,63.85 50.8,65.47 50.8,69.22 51.55,69.97 51.55,72.35 47.8,76.1 47.8,77.1 47.05,77.85 45.92,77.85 44.55,76.47 44.55,72.22 43.8,71.47 41.17,71.47 J1.3
SCL  (via drill 0.38)
  Top 0.152: v47.55,57.48 47.55,54.98 46.42,53.85 44.92,53.85 IMU.SCL/SPC | v51.67,61.6 57.55,61.6 60.42,58.73 60.42,57.48 U1.25
  Bottom 0.152: v51.67,61.6 v47.55,57.48
SDA  (via drill 0.38)
  Top 0.152: v46.3,55.35 44.92,55.35 IMU.SDA | v54.67,60.85 57.67,60.85 59.92,58.6 59.92,57.48 U1.26
  Bottom 0.152: v46.3,55.35 50.42,55.35 51.05,55.98 52.17,55.98 54.67,58.48 v54.67,60.85
TX0  (via drill 0.38)
  Top 0.152: v54.67,46.35 54.67,49.1 54.8,49.23 55.67,49.23 U1.47
  Bottom 0.152: v54.67,46.35 50.42,42.1 50.42,28.35 JP1.RXI
TX1  (via drill 0.38)
  Top 0.152: v53.92,59.35 57.92,59.35 58.92,58.35 58.92,57.48 U1.28
  Bottom 0.152: v53.92,59.35 53.92,73.85 56.67,76.6 JP2.RXI